# EAGLE design 32U4Castel (EAGLE 9.2.2)
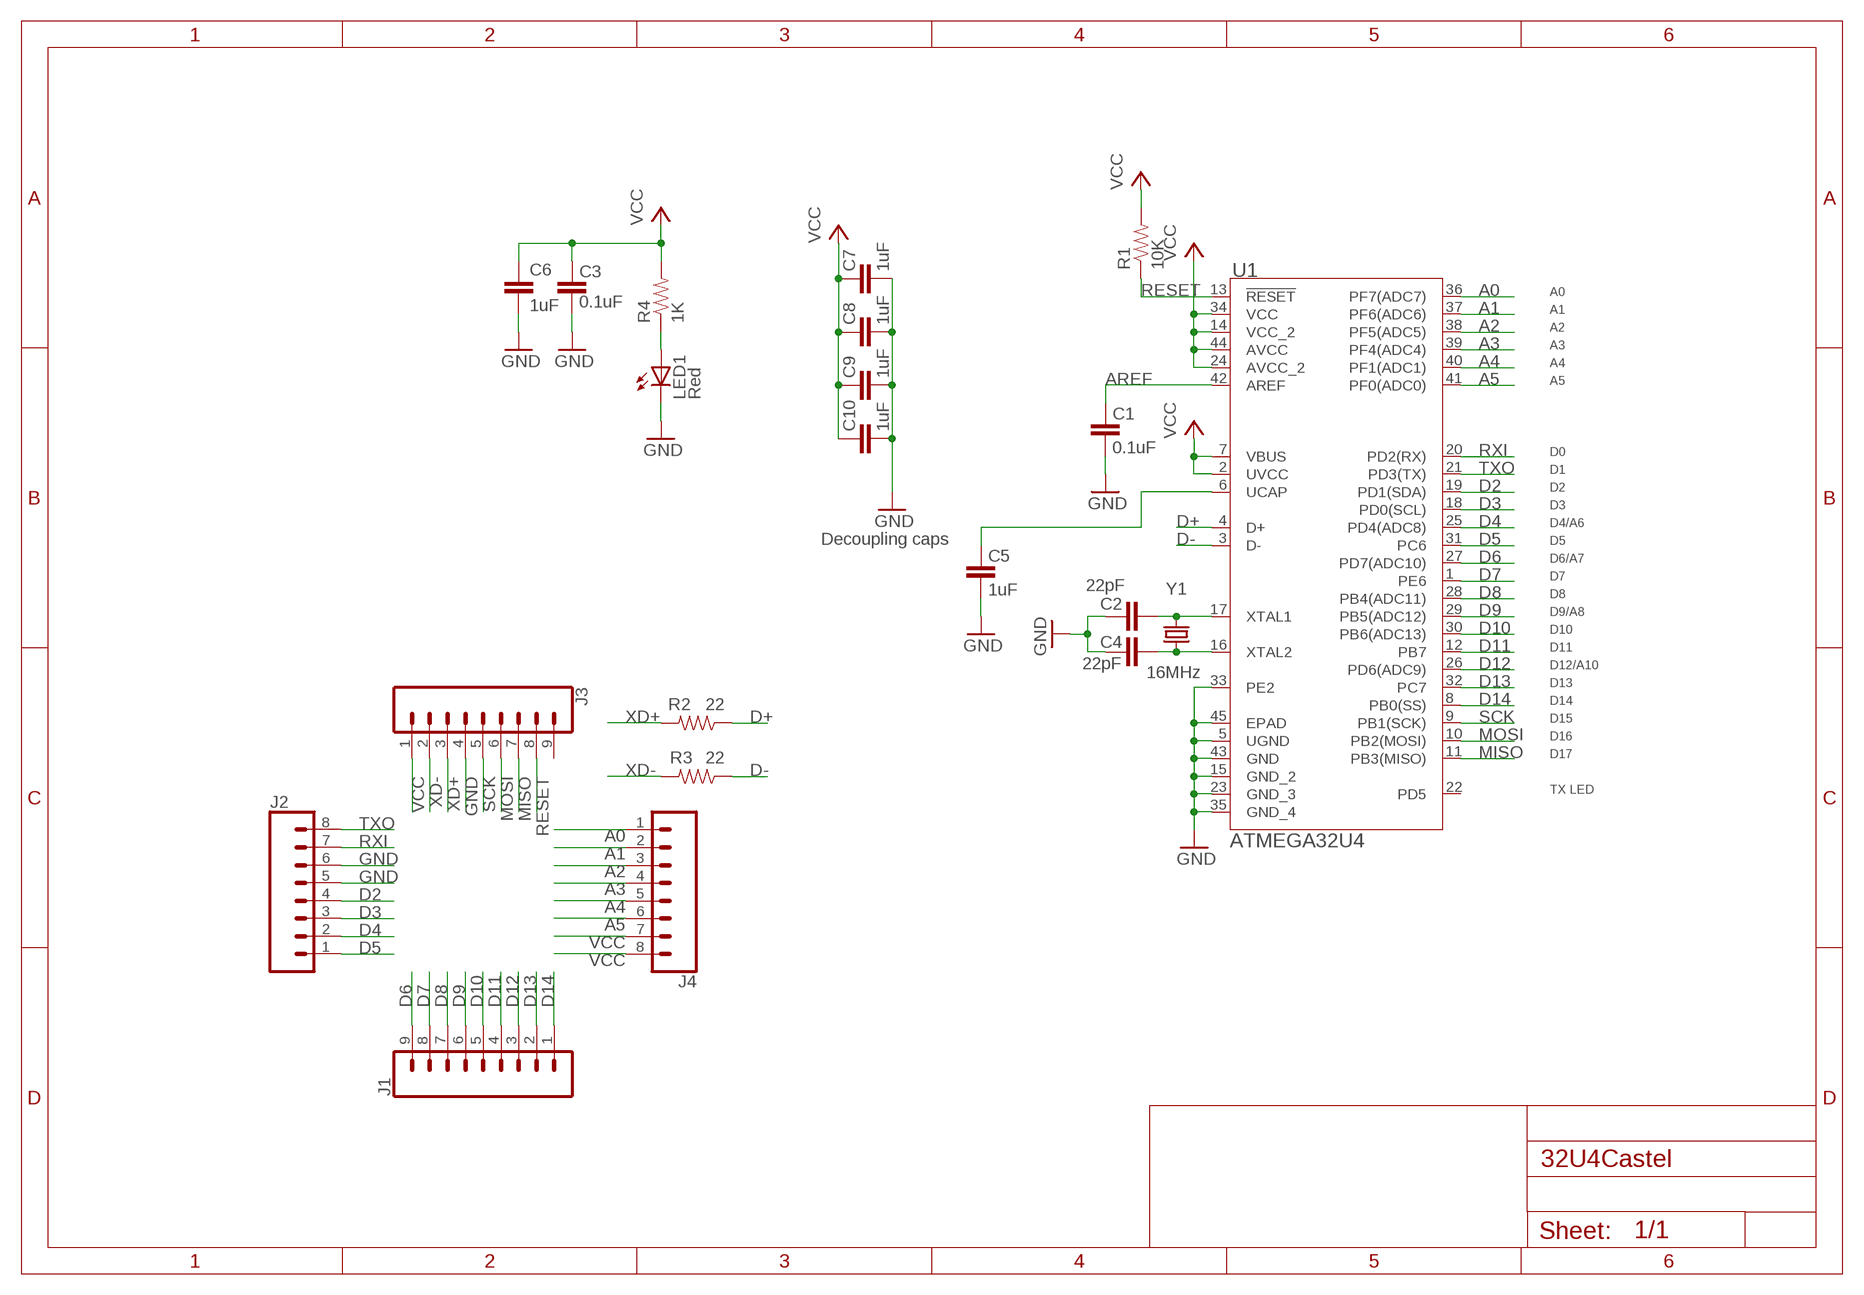
[diagram p0: schematic, sheet 1]

## Parts
C1  0.1uF  CAP0603-CAP  [0603-CAP]
C2  22pF  CAP0603-CAP  [0603-CAP]
C3  0.1uF  CAP0603-CAP  [0603-CAP]
C4  22pF  CAP0603-CAP  [0603-CAP]
C5  1uF  CAP0603-CAP  [0603-CAP]
C6  1uF  CAP0603-CAP  [0603-CAP]
C7  1uF  CAP0603-CAP  [0603-CAP]
C8  1uF  CAP0603-CAP  [0603-CAP]
C9  1uF  CAP0603-CAP  [0603-CAP]
C10  1uF  CAP0603-CAP  [0603-CAP]
J1  CONN_09NO_SILK  [1X09_NO_SILK]
J2  CONN_08NO_SILK_FEMALE_PTH  [1X08_NO_SILK]
J3  CONN_09NO_SILK  [1X09_NO_SILK]
J4  CONN_08NO_SILK_FEMALE_PTH  [1X08_NO_SILK]
LED1  Red  LED0603  [LED-0603]
R1  10K  RESISTOR0603-RES  [0603-RES]
R2  22  RESISTOR0603-RES  [0603-RES]
R3  22  RESISTOR0603-RES  [0603-RES]
R4  1K  RESISTOR0603-RES  [0603-RES]
U1  ATMEGA32U4-MU  [44PW]
Y1  16MHz  CRYSTAL5X3  [CRYSTAL-SMD-5X3]

## Nets
A0: J4.1 U1.36(PF7(ADC7))
A1: J4.2 U1.37(PF6(ADC6))
A2: J4.3 U1.38(PF5(ADC5))
A3: J4.4 U1.39(PF4(ADC4))
A4: J4.5 U1.40(PF1(ADC1))
A5: J4.6 U1.41(PF0(ADC0))
AREF: C1.2 U1.42(AREF)
D2: J2.4 U1.19(PD1(SDA))
D3: J2.3 U1.18(PD0(SCL))
D4: J2.2 U1.25(PD4(ADC8))
D5: J2.1 U1.31(PC6)
D6: J1.9 U1.27(PD7(ADC10))
D7: J1.8 U1.1(PE6)
D8: J1.7 U1.28(PB4(ADC11))
D9: J1.6 U1.29(PB5(ADC12))
D10: J1.5 U1.30(PB6(ADC13))
D11: J1.4 U1.12(PB7)
D12: J1.3 U1.26(PD6(ADC9))
D13: J1.2 U1.32(PC7)
D14: J1.1 U1.8(PB0(SS))
D+: R2.1 U1.4(D+)
D-: R3.1 U1.3(D-)
GND [vcc]: C1.1 C2.2 C3.1 C4.2 C5.1 C6.2 C7.1 C8.1 C9.1 C10.1 J2.5 J2.6 J3.4 LED1.C U1.5(UGND) U1.15(GND_2) U1.23(GND_3) U1.33(PE2) U1.35(GND_4) U1.43(GND) U1.45(EPAD)
LED: LED1.A R4.1
MISO: J3.7 U1.11(PB3(MISO))
MOSI: J3.6 U1.10(PB2(MOSI))
RESET: J3.8 R1.1 U1.13(!RESET)
RXI: J2.7 U1.20(PD2(RX))
SCK: J3.5 U1.9(PB1(SCK))
TXO: J2.8 U1.21(PD3(TX))
UCAP: C5.2 U1.6(UCAP)
VCC: C3.2 C6.1 C7.2 C8.2 C9.2 C10.2 J3.1 J4.7 J4.8 R1.2 R4.2 U1.2(UVCC) U1.7(VBUS) U1.14(VCC_2) U1.24(AVCC_2) U1.34(VCC) U1.44(AVCC)
X1: C2.1 U1.17(XTAL1) Y1.3
X2: C4.1 U1.16(XTAL2) Y1.1
XD+: J3.3 R2.2
XD-: J3.2 R3.2
Unconnected: J3.9 U1.22(PD5)

## Notes on the sheet
- Decoupling caps

## Library data of the parts
C1-C10 = SparkFun:CAP: Capacitor Standard 0603 ceramic capacitor, and 0.1" leaded capacitor.
J1 J3 = SparkFun-Connectors:CONN_09: Multi connection point. Often used as Generic Header-pin footprint for 0.1 inch spaced/style header connections On any of the 0.1 inch spaced packages, you can populate with these: Break Away Headers - Straight <https://www.sparkfun.com/products/116> (PRT-00116) Break Away Male Headers - Right Angle <https://www.sparkfun.com/products/553> (PRT-00553) Female Headers <https://www.sparkfun.com/products/115> (PRT-00115) Break Away Headers - Machine Pin <https://www.sparkfun.com/products/117> (PRT-00117) Break Away Female Headers - Swiss Machine Pin <https://www.sparkfun.com/products/743> (PRT-00743) For SCREWTERMINALS and SPRING TERMINALS visit here: Screw Terimnals on SparkFun.com <https://www.sparkfun.com/search/results?term=Screw+Terminals> (5mm/3.5mm/2.54mm spacing) This device is also useful as a general connection point to wire up your design to another part of your project. Our various solder wires solder well into these plated through hole pads. Hook-Up Wire - Assortment (Stranded, 22 AWG) <https://www.sparkfun.com/products/11375> (PRT-11375) Hook-Up Wire - Assortment (Solid Core, 22 AWG) <https://www.sparkfun.com/products/11367> (PRT-11367) View the entire wire category on our website here <https://www.sparkfun.com/categories/141> Special notes: Molex polarized connector foot print use with SKU : PRT-08231 with associated crimp pins and housings. 1MM SMD Version SKU: PRT-10208 NOTES ON THE VARIANTS LOCK and LOCK_LONGPADS... This footprint was designed to help hold the alignment of a through-hole component (i.e. 6-pin header) while soldering it into place. You may notice that each hole has been shifted either up or down by 0.005 of an inch from it's more standard position (which is a perfectly straight line). This slight alteration caused the pins (the squares in the middle) to touch the edges of the holes. Because they are alternating, it causes a "brace" to hold the component in place. 0.005 has proven to be the perfect amount of "off-center" position when using our standard breakaway headers. Although looks a little odd when you look at the bare footprint, once you have a header in there, the alteration is very hard to notice. Also,if you push a header all the way into place, it is covered up entirely on the bottom side.
J2 J4 = SparkFun-Connectors:CONN_08: Multi connection point. Often used as Generic Header-pin footprint for 0.1 inch spaced/style header connections On any of the 0.1 inch spaced packages, you can populate with these: Break Away Headers - Straight <https://www.sparkfun.com/products/116> (PRT-00116) Break Away Male Headers - Right Angle <https://www.sparkfun.com/products/553> (PRT-00553) Female Headers <https://www.sparkfun.com/products/115> (PRT-00115) Break Away Headers - Machine Pin <https://www.sparkfun.com/products/117> (PRT-00117) Break Away Female Headers - Swiss Machine Pin <https://www.sparkfun.com/products/743> (PRT-00743) Arduino Stackable Header - 8 Pin <https://www.sparkfun.com/products/9279> (PRT-09279) For SCREWTERMINALS and SPRING TERMINALS visit here: Screw Terimnals on SparkFun.com <https://www.sparkfun.com/search/results?term=Screw+Terminals> (5mm/3.5mm/2.54mm spacing) This device is also useful as a general connection point to wire up your design to another part of your project. Our various solder wires solder well into these plated through hole pads. Hook-Up Wire - Assortment (Stranded, 22 AWG) <https://www.sparkfun.com/products/11375> (PRT-11375) Hook-Up Wire - Assortment (Solid Core, 22 AWG) <https://www.sparkfun.com/products/11367> (PRT-11367) View the entire wire category on our website here <https://www.sparkfun.com/categories/141> Special notes: Molex polarized connector foot print use with SKU : PRT-08231 with associated crimp pins and housings. 1MM SMD Version SKU: PRT-10208 NOTES ON THE VARIANTS LOCK and LOCK_LONGPADS... This footprint was designed to help hold the alignment of a through-hole component (i.e. 6-pin header) while soldering it into place. You may notice that each hole has been shifted either up or down by 0.005 of an inch from it's more standard position (which is a perfectly straight line). This slight alteration caused the pins (the squares in the middle) to touch the edges of the holes. Because they are alternating, it causes a "brace" to hold the component in place. 0.005 has proven to be the perfect amount of "off-center" position when using our standard breakaway headers. Although looks a little odd when you look at the bare footprint, once you have a header in there, the alteration is very hard to notice. Also,if you push a header all the way into place, it is covered up entirely on the bottom side.; PROD_ID: CONN-08438
LED1 = SparkFun:LED: LEDs Standard schematic elements and footprints for 5mm, 3mm, 1206, and 0603 sized LEDs. 5mm - Spark Fun Electronics SKU : COM-00529 (and others)
R1-R4 = SparkFun:RESISTOR: Resistor Basic schematic elements and footprints for 0603, 1206, and PTH resistors.
U1 = 32U4:ATMEGA32U4-MU; MANUFACTURER_PART_NUMBER: ATMEGA32U4MU; VENDOR: Atmel
Y1 = SparkFun:CRYSTAL: Crystals Various standard crystals. Proven footprints. Spark Fun Electronics SKU : COM-00534

## Net classes
0 default: width 0.203 mm

## Board
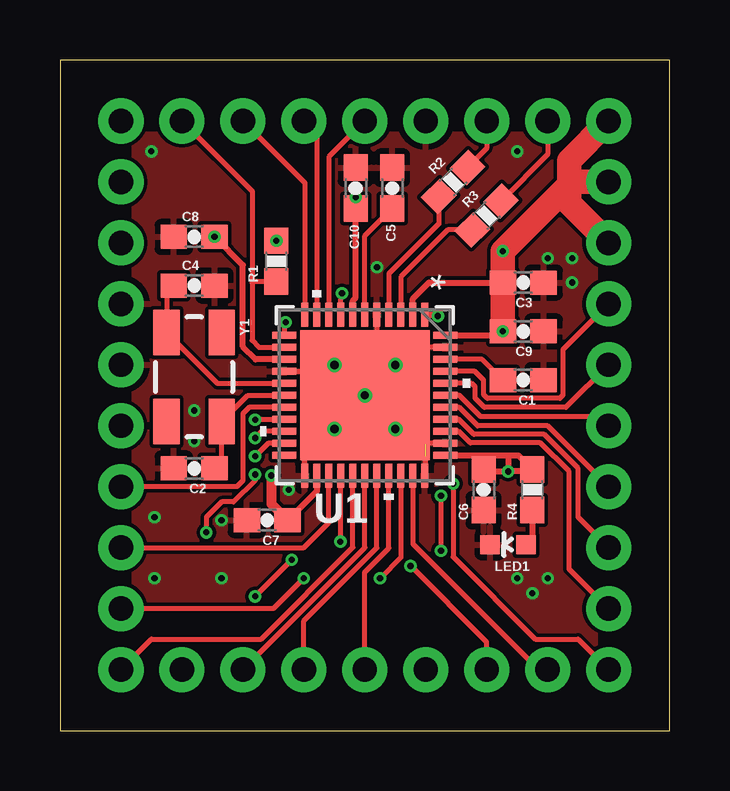
[diagram p1: board, top side]
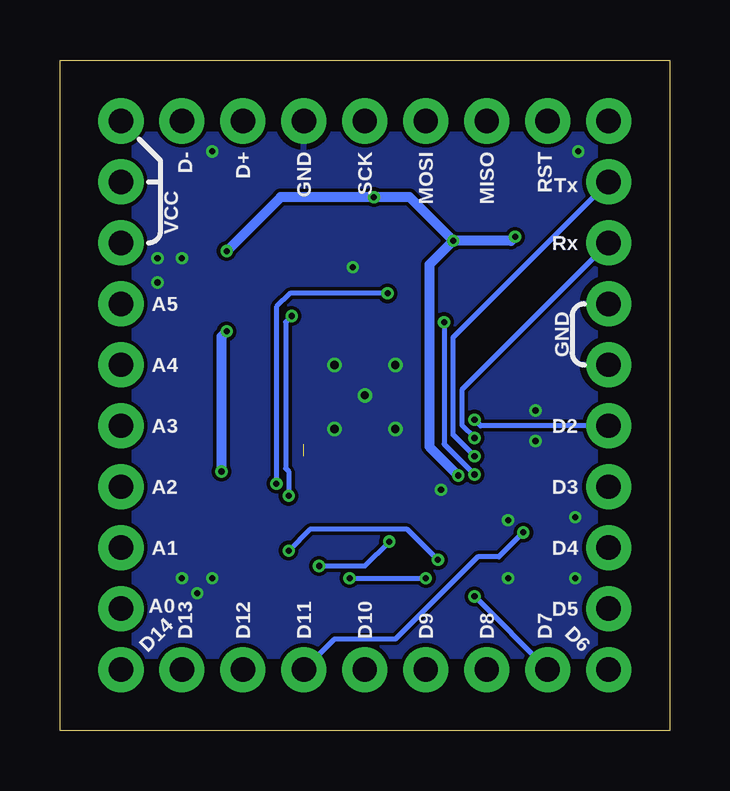
[diagram p2: board, bottom side, seen from below]

Size 25.4 x 27.94 mm. Coordinates in mm from the lower left corner, seen from the top.
Outline: 0,0 25.4,0 25.4,27.94 0,27.94 0,0
Copper layers (1*16): Top 0.035559375mm / dielectric 1.6mm / Bottom 0.035559375mm
Design rules "OshPark": minimum track width 6mil, minimum drill 10mil, track to track 6mil, track to pad 6mil, pad to pad 6mil, via to via 6mil, smd to smd 6mil, copper to edge 15mil, drill to drill 6mil, minimum pad ring 5mil, minimum via ring 5mil, stop-mask expansion 2.5mil, vias tented up to drill 0mil, thermal gap 10mil

### Footprints (pad centres in the part's own frame; a part is rotated, then mirrored left to right if it is on the bottom)
0603-CAP = smd 1.1 x 1: 1 -0.85,0; 2 0.85,0
1X09_NO_SILK = drill 1.016 pad 1.88: 1 0,0; 2 2.54,0; 3 5.08,0; 4 7.62,0; 5 10.16,0; 6 12.7,0; 7 15.24,0; 8 17.78,0; 9 20.32,0
1X08_NO_SILK = drill 1.016 pad 1.88: 1 0,0; 2 2.54,0; 3 5.08,0; 4 7.62,0; 5 10.16,0; 6 12.7,0; 7 15.24,0; 8 17.78,0
LED-0603 = smd 0.8 x 0.8: A 0,-0.75; C 0,0.75
0603-RES = smd 1.1 x 1: 1 -0.85,0; 2 0.85,0
44PW = smd 0.995 x 0.3: 1 -3.357,2.5; 2 -3.357,2; 3 -3.357,1.5; 4 -3.357,1; 5 -3.357,0.5; 6 -3.357,0; 7 -3.357,-0.5; 8 -3.357,-1; 9 -3.357,-1.5; 10 -3.357,-2; 11 -3.357,-2.5; 23 3.357,-2.5; 24 3.357,-2; 25 3.357,-1.5; 26 3.357,-1; 27 3.357,-0.5; 28 3.357,0; 29 3.357,0.5; 30 3.357,1; 31 3.357,1.5; 32 3.357,2; 33 3.357,2.5 | smd 0.3 x 0.995: 12 -2.5,-3.357; 13 -2,-3.357; 14 -1.5,-3.357; 15 -1,-3.357; 16 -0.5,-3.357; 17 0,-3.357; 18 0.5,-3.357; 19 1,-3.357; 20 1.5,-3.357; 21 2,-3.357; 22 2.5,-3.357; 34 2.5,3.357; 35 2,3.357; 36 1.5,3.357; 37 1,3.357; 38 0.5,3.357; 39 0,3.357; 40 -0.5,3.357; 41 -1,3.357; 42 -1.5,3.357; 43 -2,3.357; 44 -2.5,3.357 | smd 5.4 x 5.4: 45 0,0
CRYSTAL-SMD-5X3 = smd 1.9 x 1.1: 1 -1.85,-1.15; 2 1.85,-1.15; 3 1.85,1.15; 4 -1.85,1.15

### Placement (x,y rotation side)
C1  19.3,14.61 180 top
C2  5.59,10.92 180 top
C3  19.3,18.67 180 top
C4  5.59,18.54 0 top
C5  13.84,22.61 270 top
C6  17.65,10.03 270 top
C7  8.64,8.76 0 top
C8  5.59,20.57 0 top
C9  19.3,16.64 180 top
C10  12.32,22.61 270 top
J1  22.86,2.54 180 top
J2  2.54,5.08 90 top
J3  22.86,25.4 180 top
J4  22.86,5.08 90 top
LED1  18.67,7.75 90 top
R1  9.02,19.56 90 top
R2  16.38,22.86 45 top
R3  17.78,21.46 45 top
R4  19.68,10.03 90 top
U1  12.7,13.97 270 top
Y1  5.59,14.73 270 top

### Tracks (layer width: path | path; a pad name or v marks a point on that pad's centre or on a via)
A0
  Top 0.203: J4.1 21.21,6.73 21.21,10.79 20.02,11.99 17.1,11.99 16.64,12.45 16.61,12.47 U1.36
A1
  Top 0.203: J4.2 21.59,8.89 21.59,10.92 20.17,12.34 17.25,12.34 16.62,12.97 U1.37
A2
  Top 0.203: J4.3 20.32,12.7 17.4,12.7 16.63,13.47 U1.38
A3
  Top 0.203: J4.4 22.48,13.08 17.53,13.08 16.64,13.97 U1.39
A4
  Top 0.203: J4.5 21.08,13.46 17.68,13.46 17.29,13.85 17.29,14.33 17.15,14.47 U1.40
A5
  Top 0.203: J4.6 20.95,15.88 20.95,15.21 20.96,15.21 20.96,13.97 20.83,13.84 17.81,13.84 17.65,14 17.65,14.61 17.29,14.97 U1.41
AREF
  Top 0.203: C1.2 17.59,15.47 U1.42
D2  (via drill 0.25 pad 0.51)
  Top 0.203: v8.13,12.95 8.14,12.97 U1.19
  Bottom 0.203: J2.4 7.87,12.7 v8.13,12.95
D3
  Top 0.203: U1.18 7.88,13.47 7.62,13.21 7.62,10.41 7.37,10.16 J2.3
D4
  Top 0.203: J2.2 10.16,7.62 11.2,8.66 U1.25
D5  (via drill 0.25 pad 0.51)
  Top 0.203: U1.31 14.2,7.21 v13.34,6.35 | v10.16,6.35 8.89,5.08 J2.1
  Bottom 0.203: v13.34,6.35 v10.16,6.35
D6
  Top 0.203: J1.9 3.81,3.81 8.38,3.81 12.2,7.63 U1.27
D7  (via drill 0.25 pad 0.51)
  Top 0.203: v9.65,7.11 v8.13,5.59 | v15.88,7.49 v15.88,9.78
  Top 0.254: U1.1 15.69,17.33 v15.75,17.27
  Bottom 0.203: v15.75,17.27 16,17.02 16,10.92 15.88,10.79 v15.88,9.78 | v9.65,7.11 10.92,8.38 14.99,8.38 v15.88,7.49 | v8.13,5.59 J1.8
D8
  Top 0.203: J1.7 12.7,7.62 U1.28
D9
  Top 0.203: J1.6 10.16,4.57 13.2,7.61 U1.29
D10
  Top 0.203: J1.5 12.7,6.6 13.7,7.6 U1.30
D11  (via drill 0.25 pad 0.51)
  Top 0.203: v9.4,17.02 9.34,16.96 U1.12 | v8.13,10.67 8.13,10.41 7.24,9.53 6.73,9.53 6.1,8.89 v6.1,8.26
  Bottom 0.203: J1.4 13.97,3.81 11.43,3.81 8,7.24 7.11,7.24 v6.1,8.26 | v8.13,10.67 9.4,11.94 v9.4,17.02
D12  (via drill 0.25 pad 0.51)
  Top 0.203: J1.3 17.78,3.68 v14.61,6.86 | v11.68,7.87 11.7,7.89 U1.26
  Bottom 0.203: v14.61,6.86 12.7,6.86 v11.68,7.87
D13
  Top 0.203: J1.2 19.94,2.54 14.7,7.78 U1.32
D14  (via drill 0.25 pad 0.51)
  Top 0.203: v16.38,10.29 16.38,7.24 19.81,3.81 21.59,3.81 J1.1 | U1.8 11.7,18.17 v11.75,18.22
  Bottom 0.203: v16.38,10.29 16.38,17.65 15.81,18.22 v11.75,18.22
D+
  Top 0.203: R2.1 15.78,21.12 13.7,19.03 U1.4
D-
  Top 0.203: R3.1 16.16,20.86 14.2,18.9 U1.3
GND  (via drill 0.25 pad 0.51, 0.35)  (1 unrouted)
  Top 0.203: U1.15 10.14,14.97 10.16,14.99 | U1.23 10.2,11.34 10.29,11.43 | U1.33 15.24,10.65 15.24,11.43 | U1.35 15.27,11.97 15.24,11.94 | U1.43 15.27,15.97 15.24,16 | U1.5 13.21,17.32 13.21,16.51
  other vias: 12.7,13.97 13.97,15.24 13.97,12.57 11.43,12.57 11.43,15.24 3.94,8.89 3.94,6.35 6.73,6.35 3.81,24.13 21.34,18.67 20.32,19.68 21.34,19.68 6.73,8.76 19.68,5.71 19.05,6.35 20.32,6.35 9.53,10.03 13.21,19.3 19.05,24.13 5.59,12.06 5.59,13.34
  pour Top: 3.05,24.89 22.35,24.89 22.35,3.05 3.05,3.05
  pour Bottom: 3.05,24.89 22.35,24.89 22.35,3.05 3.05,3.05
LED
  Top 0.254: R4.1 19.68,8.01 LED1.A
MISO
  Top 0.203: J3.7 10.2,22.82 U1.11
MOSI
  Top 0.203: J3.6 10.7,24.86 U1.10
RESET
  Top 0.203: J3.8 8,22.48 8,18.67 | U1.13 8.29,15.97 8,16.26 8,18.67 | R1.1 8.04,18.71 8,18.67
RXI  (via drill 0.25 pad 0.51)
  Top 0.203: U1.20 8.41,12.47 v8.13,12.19
  Bottom 0.203: v8.13,12.19 8.64,12.7 8.64,14.22 J2.7
SCK
  Top 0.203: J3.5 11.2,23.9 U1.9
TXO  (via drill 0.25 pad 0.51)
  Top 0.203: U1.21 8.67,11.97 v8.13,11.43
  Bottom 0.203: v8.13,11.43 9.02,12.32 9.02,16.38 J2.8
UCAP
  Top 0.203: U1.6 12.7,20.61 C5.2
VCC  (via drill 0.25 pad 0.51)
  Top 0.203: U1.7
  Top 0.254: U1.34 17.65,11.47 | 17.65,11.47 18.67,11.47 | 18.67,11.47 19.1,11.47 R4.2 19.6,10.79 v18.67,10.79 | 17.65,11.47 C6.1 17.74,10.79 v18.67,10.79 | U1.44 18.29,16.47 C9.2 | U1.2 14.7,18 15.37,18.67 C3.2 | U1.24 10.7,9.98 C7.2 | U1.14 8.15,15.47 7.62,16 7.62,19.39 C8.2 | 18.67,11.47 v18.67,10.79 | 12.2,21.64 12.24,21.67 | 12.24,21.67 C10.2 | U1.7 12.2,17.91 12.32,18.03 12.32,21.59 12.24,21.67
  Top 0.406: v8.8,10.63 8.8,9.44 C7.2 | v12.32,22.23 C10.2
  Top 1.016: C9.2 C3.2 v18.45,19.98 21.21,22.73 | 21.21,22.73 21.21,23.75 J3.1 | J4.8 21.34,22.86 21.21,22.73 | J4.7 21.21,21.97 21.21,22.73
  Bottom 0.406: C8.2 6.6,20.41 R1.2 | v18.67,10.79 18.67,16.42 C9.2 | R1.2 10.01,19.42 10.01,11.83 v8.8,10.63 | R1.2 10.83,22.23 v12.32,22.23 16.21,22.23 v18.45,19.98
  other vias: 9.02,20.41 6.44,20.57 18.45,16.64
X1
  Top 0.203: C2.1 6.74,11.22 Y1.3 7.72,13.87 7.83,13.97 U1.17
X2
  Top 0.203: C4.1 4.44,18.24 Y1.1 6.56,14.46 U1.16
XD+
  Top 0.203: J3.3 17.78,24.26 R2.2
XD-
  Top 0.203: J3.2 20.32,24 R3.2

### Text on the board
bPlace: RST | MISO | MOSI | SCK | GND | D+ | D- | Tx | VCC | Rx | A5 | GND | A4 | D2 | A3 | D3 | A2 | D4 | A1 | D5 | A0 | D7 | D8 | D9 | D10 | D11 | D12 | D13 | D6 | D14